# Altium project AC_Measure.PrjPcb
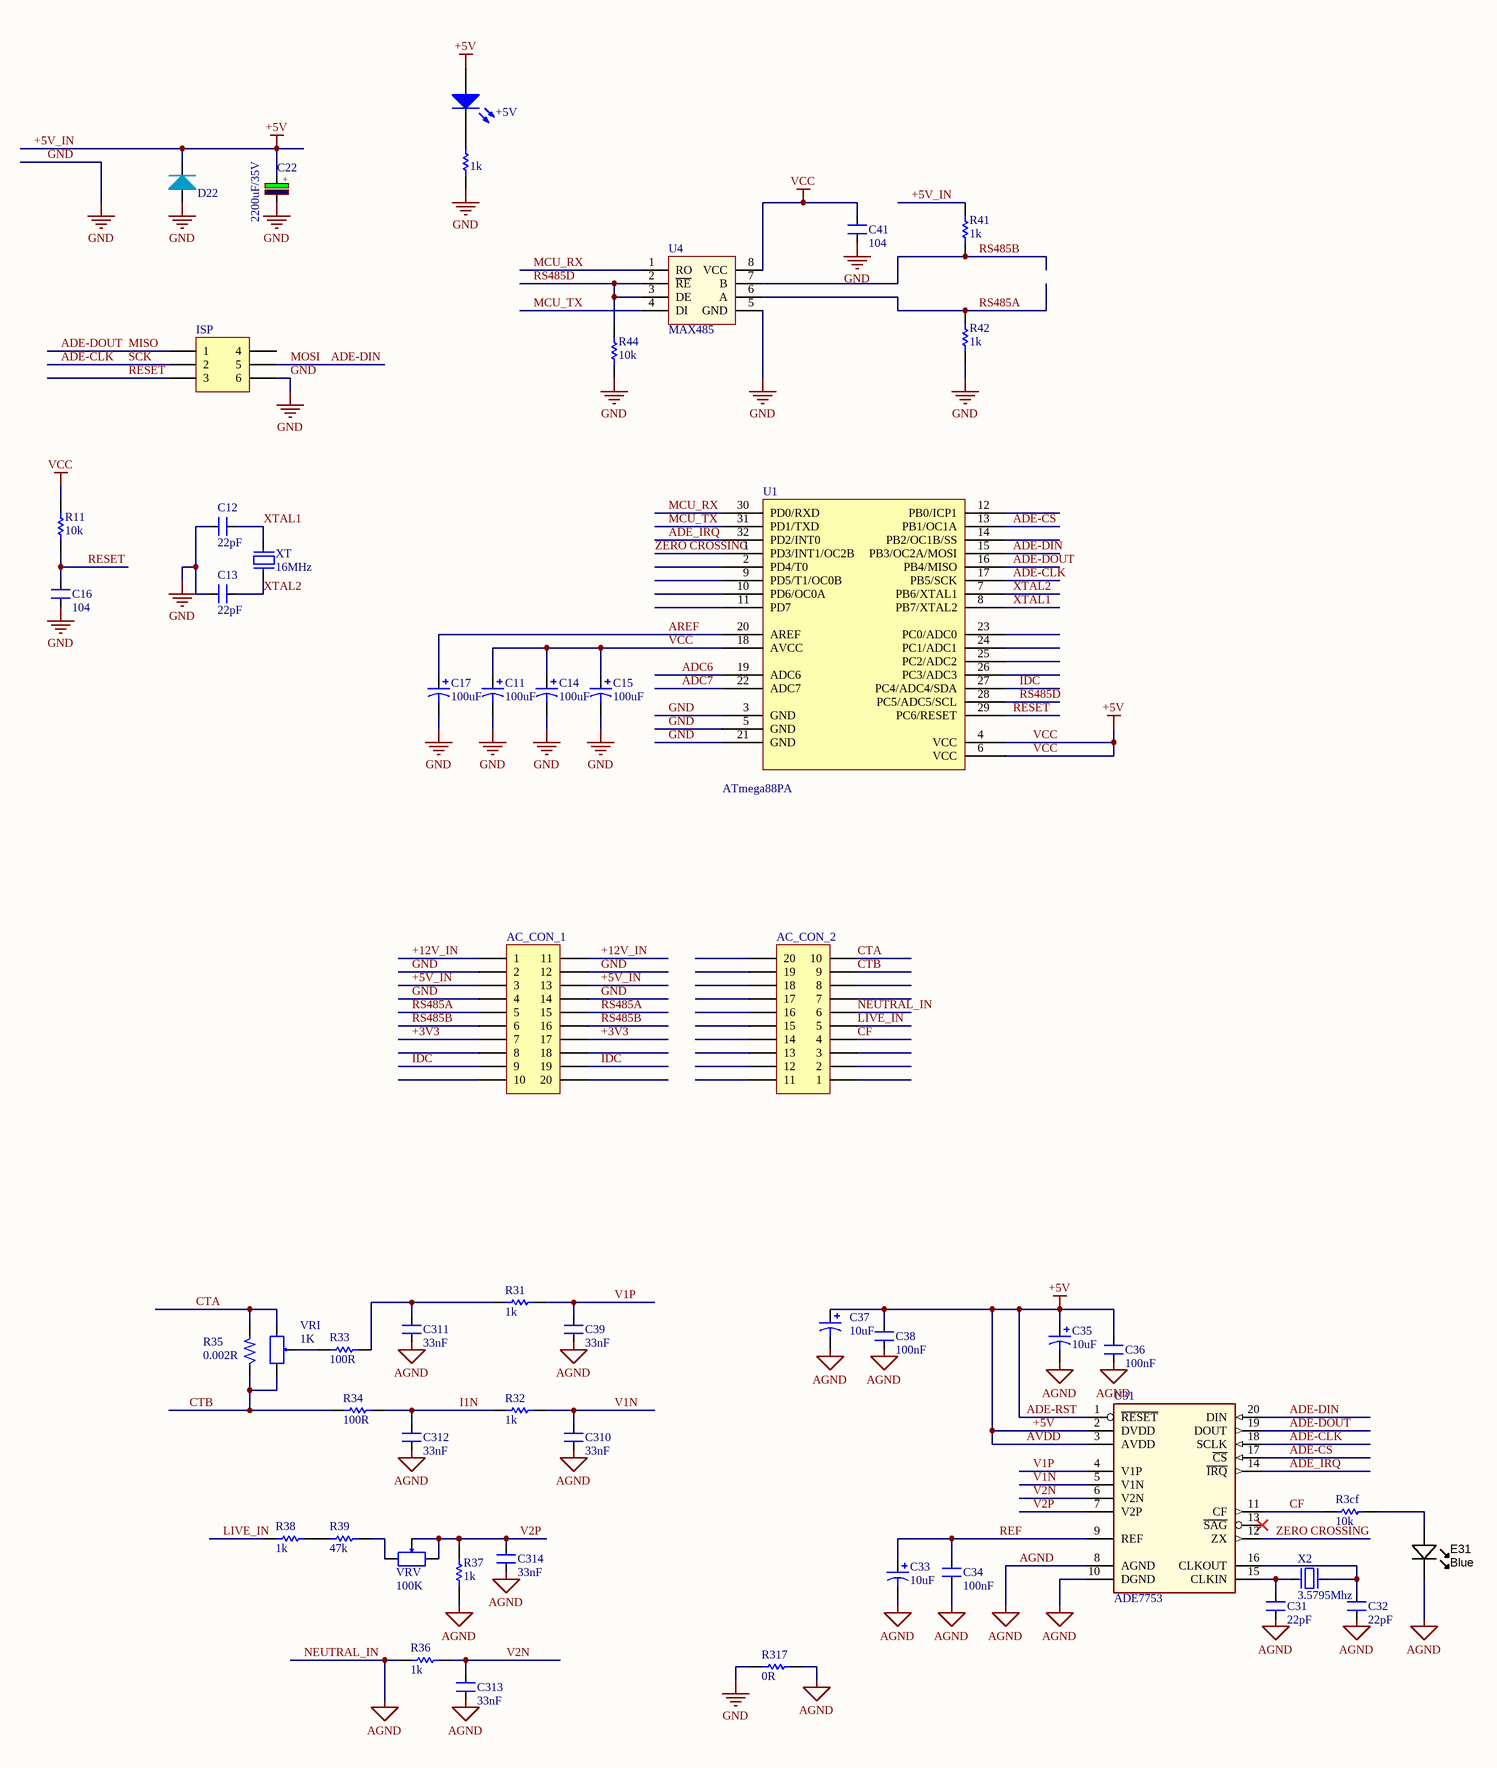
[diagram p0: AC2_Measure.SchDoc]
1 sheet, 52 parts. Net scope: global (net labels, ports and power ports of the same name join across sheets).
Board file: AC_Measure.PcbDoc

## Sheet AC2_Measure.SchDoc
size A2

### Parts
+5V  Led  [LED 5mm RED]  (value not drawn)
AC_CON_1  Header 10X2A  [OMC10]  (value not drawn)
AC_CON_2  Header 10X2A  [OMC10]  (value not drawn)
C11  value 100uF  [CAPC2012N_F]  (hidden comment: Cap)
C12  value 22pF  [CAPC1608N]  (hidden comment: CAP NP)
C13  value 22pF  [CAPC1608N]  (hidden comment: CAP NP)
C14  value 100uF  [CAPC2012N_F]  (hidden comment: Cap)
C15  value 100uF  [CAPC2012N_F]  (hidden comment: Cap)
C16  value 104  [CAPC1608N]  (hidden comment: CAP NP)
C17  value 100uF  [CAPC2012N_F]  (hidden comment: Cap)
C22  2200uF/35V  [CAP_ELEC_SIZE_G]
C31  value 22pF  [CAPC1608N]  (hidden comment: CAP NP)
C32  value 22pF  [CAPC1608N]  (hidden comment: CAP NP)
C33  value 10uF  [CAPC2012N_F]  (hidden comment: Cap)
C34  value 100nF  [CAPC1608N]  (hidden comment: CAP NP)
C35  value 10uF  [CAPC2012N_F]  (hidden comment: Cap)
C36  value 100nF  [CAPC1608N]  (hidden comment: CAP NP)
C37  value 10uF  [CAPC2012N_F]  (hidden comment: Cap)
C38  value 100nF  [CAPC1608N]  (hidden comment: CAP NP)
C39  value 33nF  [CAPC1608N]  (hidden comment: CAP NP)
C41  value 104  [CAPC2012N_F]  (hidden comment: 100nF/104)
C310  value 33nF  [CAPC1608N]  (hidden comment: CAP NP)
C311  value 33nF  [CAPC1608N]  (hidden comment: CAP NP)
C312  value 33nF  [CAPC1608N]  (hidden comment: CAP NP)
C313  value 33nF  [CAPC1608N]  (hidden comment: CAP NP)
C314  value 33nF  [CAPC1608N]  (hidden comment: CAP NP)
D22  Diode  [DO-214AC]  (value not drawn)
E31  Blue  [LED-0805-K]
ISP  Header 3X2A  [HDR2X3_CEN]  (value not drawn)
R3cf  value 10k  [0603ESDA]  (hidden comment: Res)
R11  value 10k  [RESC1608N_ZERO]  (hidden comment: Res)
R22  value 1k  [RESC2012N_F]  (hidden comment: Res_0805_1k)
R31  value 1k  [0603ESDA]  (hidden comment: Res)
R32  value 1k  [0603ESDA]  (hidden comment: Res)
R33  value 100R  [0603ESDA]  (hidden comment: Res)
R34  value 100R  [0603ESDA]  (hidden comment: Res)
R35  0.002R  [RESC6332N]
R36  value 1k  [0603ESDA]  (hidden comment: Res)
R37  value 1k  [0603ESDA]  (hidden comment: Res)
R38  value 1k  [RESC2012N_F]  (hidden comment: Res)
R39  value 47k  [RESC2012N_F]  (hidden comment: Res)
R41  1k  [RESC1608N_ZERO]
R42  1k  [RESC1608N_ZERO]
R44  value 10k  [RESC1608N_ZERO]  (hidden comment: 330R)
R317  value 0R  [RESC2012N_F]  (hidden comment: Res)
U1  ATmega88PA  [32PIN]
U4  MAX485  [SO-8]
U31  ADE7753  [TSSOP-20]
VRI  1K  [VR1]
VRV  100K  [VR1]
X2  3.5795Mhz  [XT2]
XT  16MHz  [XT2]

### Nets
+5V: +5V.1(A) AC_CON_1.3 AC_CON_1.13 C11.1 C14.1 C15.1 C22.1 C35.1 C36.2 C37.1 C38.2 C41.2 D22.2(K) R11.2 R41.2 U1.4(VCC) U1.6(VCC) U1.18(AVCC) U4.8(VCC) U31.1(~{RESET}) U31.2(DVDD) U31.3(AVDD)  [also labelled +5V_IN, ADE-RST, AVDD, VCC]
AGND: AC_CON_2.6 C31.1 C32.1 C33.2 C34.1 C35.2 C36.1 C37.2 C38.1 C39.1 C310.1 C311.1 C312.1 C313.1 C314.1 E31.K R36.1 R37.1 R317.2 U31.8(AGND) U31.10(DGND)  [also labelled NEUTRAL_IN]
GND: AC_CON_1.2 AC_CON_1.4 AC_CON_1.12 AC_CON_1.14 C11.2 C12.2 C13.2 C14.2 C15.2 C16.1 C17.2 C22.2 C41.1 D22.1(A) ISP.6 R22.2 R42.1 R44.1 R317.1 U1.3(GND) U1.5(GND) U1.21(GND) U4.5(GND)
+3V3: AC_CON_1.7 AC_CON_1.17
+12V_IN: AC_CON_1.1 AC_CON_1.11
ADC6: U1.19(ADC6)
ADC7: U1.22(ADC7)
ADE-CLK: ISP.2 U1.17(PB5/SCK) U31.18(SCLK)  [also labelled SCK]
ADE-CS: U1.13(PB1/OC1A) U31.17(~{CS})
ADE-DIN: ISP.5 U1.15(PB3/OC2A/MOSI) U31.20(DIN)  [also labelled MOSI]
ADE-DOUT: ISP.1 U1.16(PB4/MISO) U31.19(DOUT)  [also labelled MISO]
ADE_IRQ: U1.32(PD2/INT0) U31.14(~{IRQ})
AREF: C17.1 U1.20(AREF)
CF: AC_CON_2.4 R3cf.1 U31.11(CF)
CTA: AC_CON_2.10 R35.2 VRI.1
CTB: AC_CON_2.9 R34.1 R35.1 VRI.3
I1N: C312.2 R32.1 R34.2
IDC: AC_CON_1.9 AC_CON_1.19 U1.27(PC4/ADC4/SDA)
LIVE_IN: AC_CON_2.5 R38.1
MCU_RX: U1.30(PD0/RXD) U4.1(RO)
MCU_TX: U1.31(PD1/TXD) U4.4(DI)
REF: C33.1 C34.2 U31.9(REF)
RESET: C16.2 ISP.3 R11.1 U1.29(PC6/RESET)
RS485A: AC_CON_1.5 AC_CON_1.15 R42.2 U4.6(A)
RS485B: AC_CON_1.6 AC_CON_1.16 R41.1 U4.7(B)
RS485D: R44.2 U1.28(PC5/ADC5/SCL) U4.2(~{RE}) U4.3(DE)
V1N: C310.2 R32.2 U31.5(V1N)
V1P: C39.2 R31.2 U31.4(V1P)
V2N: C313.2 R36.2 U31.6(V2N)
V2P: C314.2 R37.2 U31.7(V2P) VRV.2 VRV.3
XTAL1: C12.1 U1.8(PB7/XTAL2) XT.2
XTAL2: C13.1 U1.7(PB6/XTAL1) XT.1
ZERO CROSSING: U1.1(PD3/INT1/OC2B) U31.12(ZX)
Net+5V_2: +5V.2(K) R22.1
NetC31_2: C31.2 U31.15(CLKIN) X2.2
NetC32_2: C32.2 U31.16(CLKOUT) X2.1
NetC311_2: C311.2 R31.1 R33.2
NetE31_A: E31.A R3cf.2
NetR33_1: R33.1 VRI.2
NetR38_2: R38.2 R39.1
NetR39_2: R39.2 VRV.1

Not connected (* = marked no-connect by the designer): AC_CON_1 8 10 18 20; AC_CON_2 1 2 3 7 8 11 12 13 14 15 16 17 18 19 20; ISP 4; U1 2(PD4/T0) 9(PD5/T1/OC0B) 10(PD6/OC0A) 11(PD7) 12(PB0/ICP1) 14(PB2/OC1B/SS) 23(PC0/ADC0) 24(PC1/ADC1) 25(PC2/ADC2) 26(PC3/ADC3); U31 13(~{SAG})*

### Notes on the sheet
- (in symbol CP4) +

### Library data of the parts
+5V = Led: pin to pad: 1>A 2>K
AC_CON_1 AC_CON_2 = Header 10X2A: Header, 10-Pin, Dual row; LatestRevisionDate: 17-Jul-2002; LatestRevisionNote: Re-released for DXP Platform.; Publisher: Altium Limited
C22 = CP4: Cap 1000uF/16V - 220uF/50V; Description 5: 4,7uF>10uF/250V_3,3uF>10uF/400V - 2,2uF>4,7uF/450V; Description 1: 2200uF-3300uF/6,3V - 1000uF-2200uF/10V; Description 2: 1000uF/16V - 470uF => 1000uF/25V - 100uF/100V; Description 3: 330uF>470uF/35V_220uF>470uF/50V_10uF>22uF/250V; Description 4: 220uF => 330uF/63V - 10uF =>33uF/160 - 200V; Value: 1000uF/16V
C41 = CAP NP
D22 = Diode: pin to pad: 1>A 2>K
E31 = LED_SMD_Blue_0805_100mcd: LED 0805 SMD Blue 100mcd 470nm; Manufacturer 1: Ligitek; Manufacturer Part Number 1: LG-170DBKZ-CT; Ratings: 100 mcd; 470 nm; Package / Case: 0805; Material: InGaN/GaN; Value: Blue; Color: Blue
ISP = Header 3X2A: Header, 3-Pin, Dual row; LatestRevisionDate: 17-Jul-2002; LatestRevisionNote: Re-released for DXP Platform.; Publisher: Altium Limited
R22 = Res
R35 = R: Resistor 1/4W; Value: 2512/1W/1%
R41 R42 R44 = Res: Tro dan
  R41 R42: Value: 1k
U1 = ATmega48/168/328
U4 = MAX485: RS232 - RS485 (Same sn75176)
U31 = ADE7753: Single-Phase Multifunction Metering IC with di/dt Sensor Interface
VRI VRV = VR: Var Resistor; Value: VR 10K
X2 = XT2: Crystal For all Crystal 2pin.; Value: 4Mhz
XT = Crystal